# Altium schematic sheet SmartSwitch433SCH.SchDoc
size B; SheetNumber: 1; SheetTotal: 1
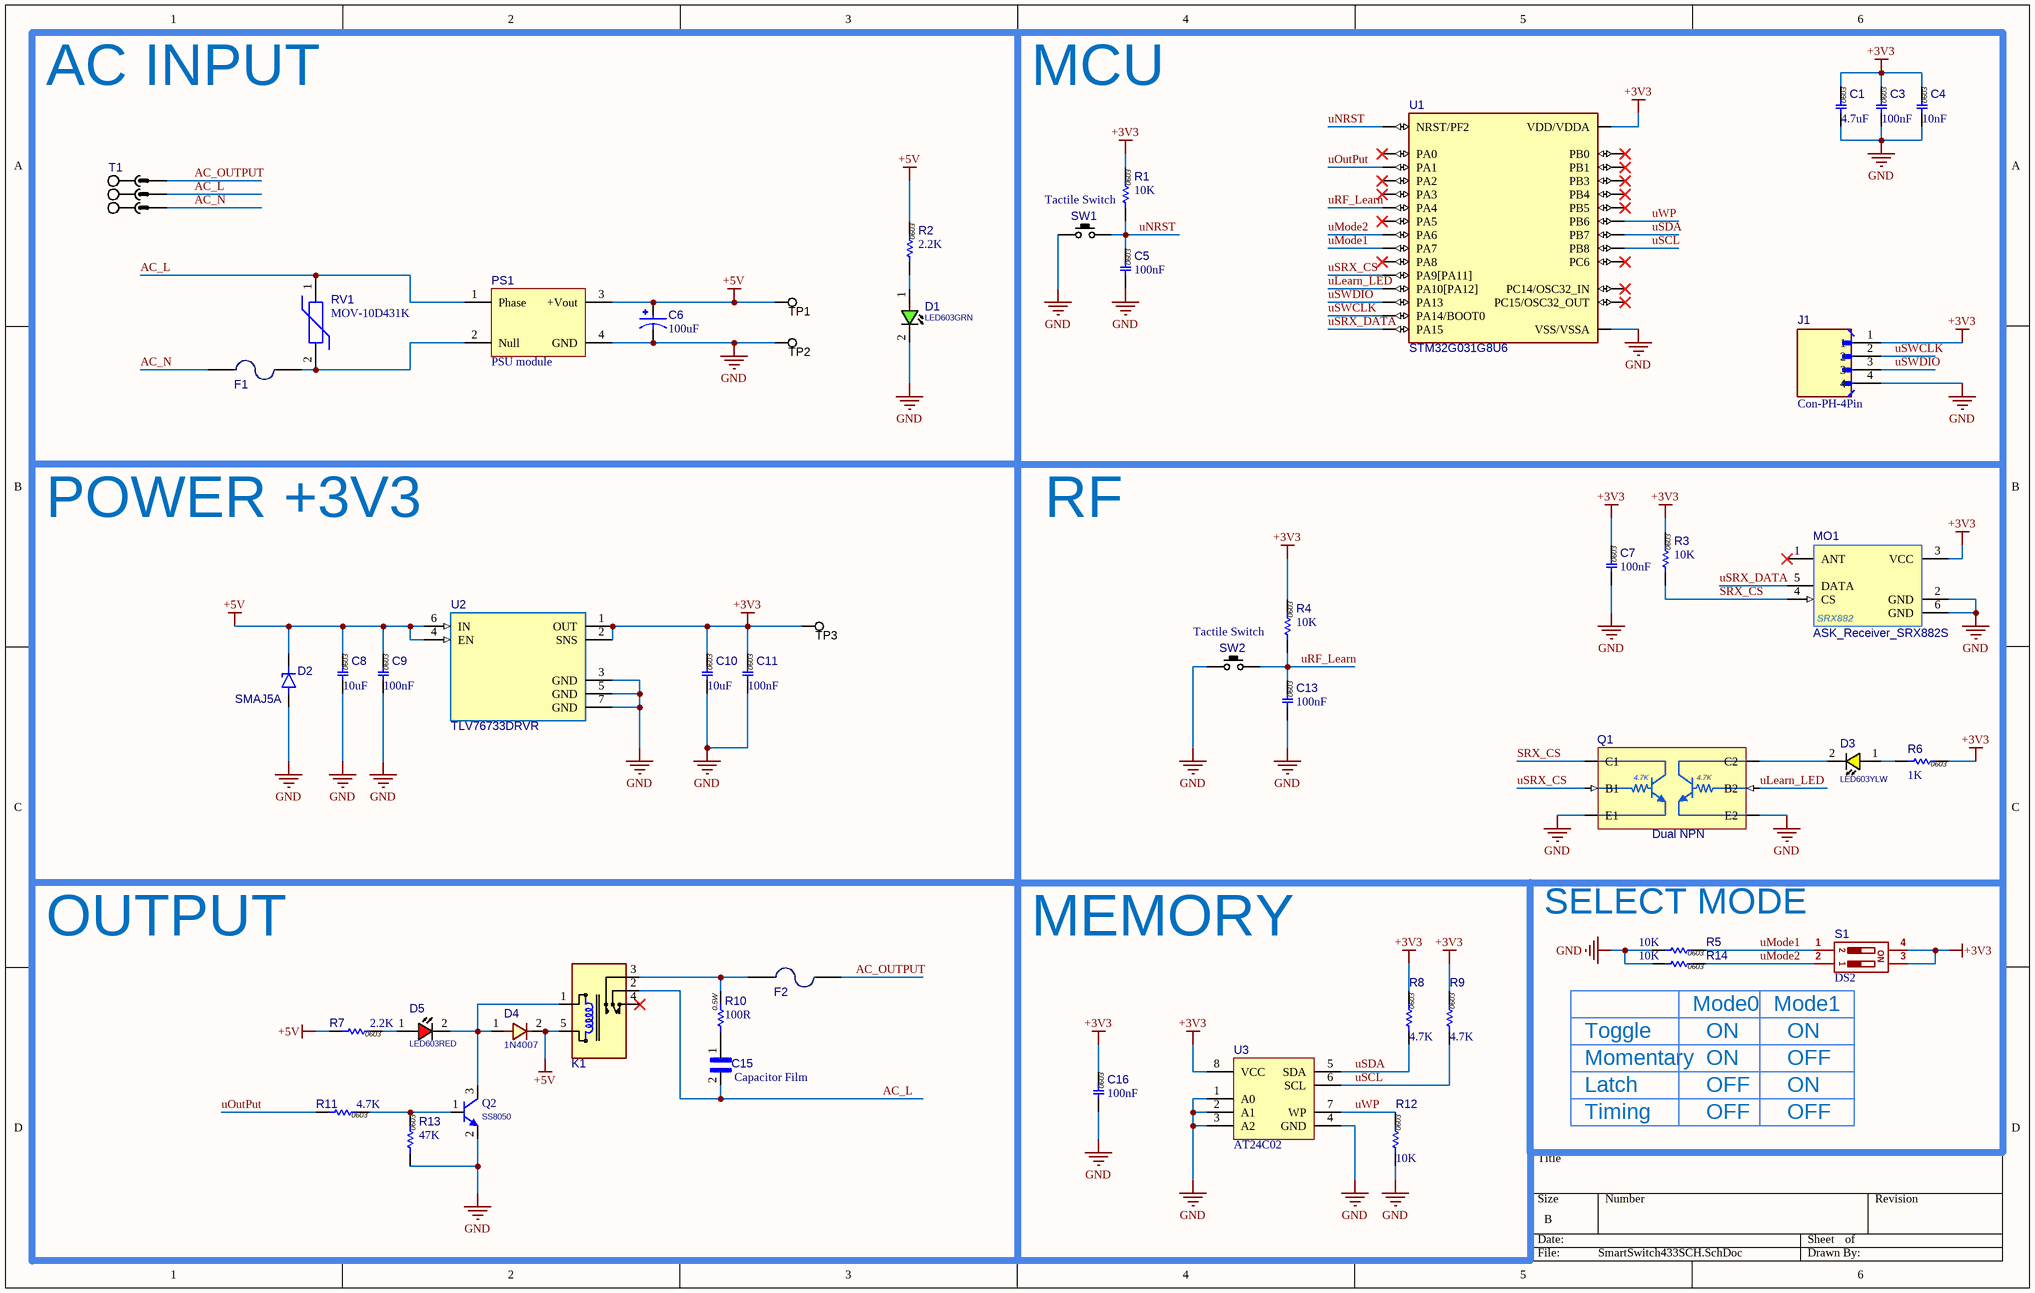
[diagram p0: SmartSwitch433SCH.SchDoc]

## Parts
C1  4.7uF  [Cap SMD 0603]
C3  100nF  [Cap SMD 0603]
C4  10nF  [Cap SMD 0603]
C5  100nF  [Cap SMD 0603]
C6  100uF  [Cap Electrolytic Radial . 6.3 * 12]
C7  100nF  [Cap SMD 0603]
C8  10uF  [Cap SMD 0603]
C9  100nF  [Cap SMD 0603]
C10  10uF  [Cap SMD 0603]
C11  100nF  [Cap SMD 0603]
C13  100nF  [Cap SMD 0603]
C15  Capacitor Film  [Capacitor Film2]
C16  100nF  [Cap SMD 0603]
D1  LED603GRN  [LED0603GRN]
D2  SMAJ5A  [SMAJ15A]
D3  LED603YLW  [LED0603YLW]
D4  1N4007  [D_SMA]
D5  LED603RED  [LED0603RED]
F1  250V-0.2A  [Fuse 5x20]  (value not drawn)
F2  250V-0.2A  [Fuse 5x20]  (value not drawn)
J1  Con-PH-4Pin  [Con-PH-4Pin-ST]
K1  Relay  [Relay-G5Q-14]  (value not drawn)
MO1  ASK_Receiver_SRX882S  [ASK_Receiver_SRX882S]
PS1  PSU module  [PSU module 3W]
Q1  Dual NPN  [PUMH7]
Q2  SS8050  [SOT23_3]
R1  10K  [Res SMD 0603]
R2  2.2K  [Res SMD 0603]
R3  10K  [Res SMD 0603]
R4  10K  [Res SMD 0603]
R5  10K  [Res SMD 0603]
R6  1K  [Res SMD 0603]
R7  2.2K  [Res SMD 0603]
R8  4.7K  [Res SMD 0603]
R9  4.7K  [Res SMD 0603]
R10  100R  [Res THD 0.5w]
R11  4.7K  [Res SMD 0603]
R12  10K  [Res SMD 0603]
R13  47K  [Res SMD 0603]
R14  10K  [Res SMD 0603]
RV1  MOV-10D431K  [MOV-10D391K]
S1  DS2  [DIP Switch x2]
SW1  Tactile Switch  [Tactil Switch 3*4*2]
SW2  Tactile Switch  [Tactile Switch 3*6*5]
T1  (no value)  [MSTB 2,5/3-G-5,08]
TP1  TESTPOINT_SMD  [TPSMD_S1]  (value not drawn)  (no BOM)
TP2  TESTPOINT_SMD  [TPSMD_S1]  (value not drawn)  (no BOM)
TP3  TESTPOINT_SMD  [TPSMD_S1]  (value not drawn)  (no BOM)
U1  STM32G031G8U6  [STM32G031G8U6]
U2  TLV76733DRVR  [TLV76733DRVR]
U3  AT24C02  [SO8_NARROW_N]

## Nets
+3V3: C1.2 C3.2 C4.2 C7.2 C10.2 C11.2 C16.2 J1.1 MO1.3(VCC) R1.2 R3.2 R4.2 R6.2 R8.2 R9.2 S1.3 S1.4 TP3.1 U1.3(VDD/VDDA) U2.1(OUT) U2.2(SNS) U3.8(VCC)
+5V: C6.P C8.2 C9.2 D2.C D4.2 K1.5(T2) PS1.3(+Vout) R2.2 R7.1 TP1.1 U2.4(EN) U2.6(IN)
GND: C1.1 C3.1 C4.1 C5.1 C6.N C7.1 C8.1 C9.1 C10.1 C11.1 C13.1 C16.1 D1.2(CATHODE) D2.A J1.4 MO1.2(GND) MO1.6(GND) PS1.4(GND) Q1.1(E1) Q1.4(E2) Q2.2(E) R5.1 R12.1 R13.1 R14.1 SW1.1(P1) SW2.1(P1) TP2.1 U1.4(VSS/VSSA) U2.3(GND) U2.5(GND) U2.7(GND) U3.1(A0) U3.2(A1) U3.3(A2) U3.4(GND)
AC_L: C15.2 K1.2(COM) PS1.1(Phase) RV1.1 T1.2
AC_N: F1.1 T1.3
AC_OUTPUT: F2.2 T1.1
SRX_CS: MO1.4(CS) Q1.6(C1) R3.1
uLearn_LED: Q1.5(B2) U1.19(PA10[PA12])
uMode1: R5.2 S1.1 U1.13(PA7)
uMode2: R14.2 S1.2 U1.12(PA6)
uNRST: C5.2 R1.1 SW1.2(P3) U1.5(NRST/PF2)
uOutPut: R11.1 U1.7(PA1)
uRF_Learn: C13.2 R4.1 SW2.2(P3) U1.10(PA4)
uSCL: R9.1 U1.28(PB8) U3.6(SCL)
uSDA: R8.1 U1.27(PB7) U3.5(SDA)
uSRX_CS: Q1.2(B1) U1.18(PA9[PA11])
uSRX_DATA: MO1.5(DATA) U1.22(PA15)
uSWCLK: J1.2 U1.21(PA14/BOOT0)
uSWDIO: J1.3 U1.20(PA13)
uWP: R12.2 U1.26(PB6) U3.7(WP)
NetC15_1: C15.1 R10.1
NetD1_1: D1.1(ANODE) R2.1
NetD3_1: D3.1(ANODE) R6.1
NetD3_2: D3.2(CATHODE) Q1.3(C2)
NetD4_1: D4.1 D5.2(CATHODE) K1.1(T1) Q2.3(C)
NetD5_1: D5.1(ANODE) R7.2
NetF1_2: F1.2 PS1.2(Null) RV1.2
NetF2_1: F2.1 K1.3(NO) R10.2
NetQ2_1: Q2.1(B) R11.2 R13.2

Not connected (* = marked no-connect by the designer): K1 4(NC)*; MO1 1(ANT)*; U1 1(PC14/OSC32_IN)* 2(PC15/OSC32_OUT)* 6(PA0)* 8(PA2)* 9(PA3)* 11(PA5)* 14(PB0)* 15(PB1)* 16(PA8)* 17(PC6)* 23(PB3)* 24(PB4)* 25(PB5)*

## Notes on the sheet
- AC INPUT
- MCU
- POWER +3V3
- RF
- OUTPUT
- MEMORY
- SELECT MODE
- Toggle
- Mode0
- ON
- (near S1) Mode1
- Momentary
- Latch
- OFF
- Timing
- (in symbol ASK_Receiver_SRX882S) SRX882
- (in symbol Cap SMD 0603) 0603
- (in symbol DIP Switch 2) ON
- (in symbol PUMH7) 4.7K
- (in symbol Res SMD 0603) 0603
- (in symbol Res THD 0.5w) 0.5W

## Library data of the parts
C1 C3-C5 C7-C11 C13 C16 = Cap SMD 0603
  C1: VALUE: 4.7uF
  C3 C5 C7 C9 C11 C13 C16: VALUE: 100nF
  C4: VALUE: 10nF
  C8 C10: VALUE: 10uF
C6 = Cap Electrolytic Radial . 6.3 * 12
C15 = Capacitor Film: Capacitor Film Pitch=10mm
D1 = LED_SMD_0603_GRN: LED, SMD, 0603, GREEN; PARAM: 20mA; MANF: Kingbright; DESC: DESCRIPTION; MANF_P#: APT1608SGC; PARAM2: 2.2V; ASSEMBLY: ASSEMBLY; PRICE: 1: 0.14$, 100: 6.8$; VALUE: LED603GRN
D2 = SMAJ15A: TVS Diode Uni-directional 15V SMA  BR Voltage : 16.7V  Clamping Volatage : 24.4V
D3 = LED_SMD_0603_YLW: LED, SMD, 0603, YELLOW; DESC: DESCRIPTION; MANF_P#: MANF_PART#; PARAM2: 2.2V; MANF: MANF; ASSEMBLY: ASSEMBLY; PRICE: PRICE; VALUE: LED603YLW
D4 = DIODE_SMD_1N4007: DIODE, GENERAL PURPOSE, 1000V/1A; MANF: Kingtronics; DESC: DESCRIPTION; PARAM: 1000V VRRM; PARAM2: 1A; MANF_P#: M7; ASSEMBLY: ASSEMBLY; PRICE: PRICE; VALUE: 1N4007
D5 = LED_SMD_0603_RED: LED, SMD, 0603, RED; PARAM: 30mA, 640nm; DESC: DESCRIPTION; MANF_P#: MANF_PART#; PARAM2: 1.8~2.5V; MANF: MANF; ASSEMBLY: ASSEMBLY; PRICE: PRICE; VALUE: LED603RED
F1 F2 = Fuse 5x20-Holder: Fuses 5x20; Value: 250V-0.2A; Publisher: Majid Derhambakhsh
J1 = Con-PH-4Pin: Connector Header Through Hole 4 position 0.079 (2.00mm)
K1 = Relay: General Purpose Sealed Relay SPDT
MO1 = ASK_Receiver_SRX882S: RF Receiver 315/433Mhz
PS1 = PSU module: AC / DC Converter
Q1 = PUMH7: 2 NPN 50V 100mA Transistors (Resistor-Equipped R1 = 4.7kΩ) SOT-363
Q2 = NPN_SS8050_SOT23: BJT, NPN, 25v, 1.5A, SMD, SOT23; PARAM2: 300mW; MANF: GALAXY; PARAM: 25v, 1.5A; MANF_P#: SS8050; VALUE: SS8050
R1-R9 R11-R14 = Res SMD 0603
  R1 R3-R5 R12 R14: VALUE: 10K
  R2 R7: VALUE: 2.2K
  R6: VALUE: 1K
  R8 R9 R11: VALUE: 4.7K
  R13: VALUE: 47K
R10 = Res THD 0.5w: Resistor 1/2W; Rating: 0.5w; Value: 100R; Type: 10%; Package: THD
RV1 = MOV-10D391K: MOV-10D Series Metal Oxide Varistor . Lead to lead distance 7.5mm .Clamping 650V, Varistor 250V | Bourns MOV-10D391K
S1 = DIP Switch 2: 2 BIT DIP Switch; Library Link: https://github.com/Majid-Derhambakhsh; Publisher: Majid Derhambakhsh
SW1 = Tactile Switch: 3x6x5 mm - 2 Pin
T1 = Phoenix MSTB-03: 3 Pitch: 5.08 mm Color: green Contact surface: Tin Assembly; Voltage: 320 V; Current: 10A; Library Link: https://github.com/Majid-Derhambakhsh; MP: PHOENIX; Publisher: Majid Derhambakhsh
TP1-TP3 = TESTPOINT_SMD: TEST POINT; MANF: MANF; MANF_P#: MANF_P#; VALUE: VALUE
U1 = STM32G031G8U6: ARM Cortex-M0+ STM32G0 Microcontroller IC 32-Bit 64MHz 64KB (64K x 8) FLASH 28-UFQFPN (4x4)
U2 = TLV76733DRVR: Adjustable- and fixed-output, 1-A, 16-V, positive-voltage low-dropout (LDO) linear regulator
U3 = IC_Memory_AT24C02: EEPROM Memory; Rating: 2K; Validation: Valid; Inflow: inflow?; Type: EEPROM; Package: SO-8; Value: AT24C02